# Altium schematic sheet Single Side Filter.SchDoc
size 287 x 198 mm; SheetNumber: 2; SheetTotal: 2
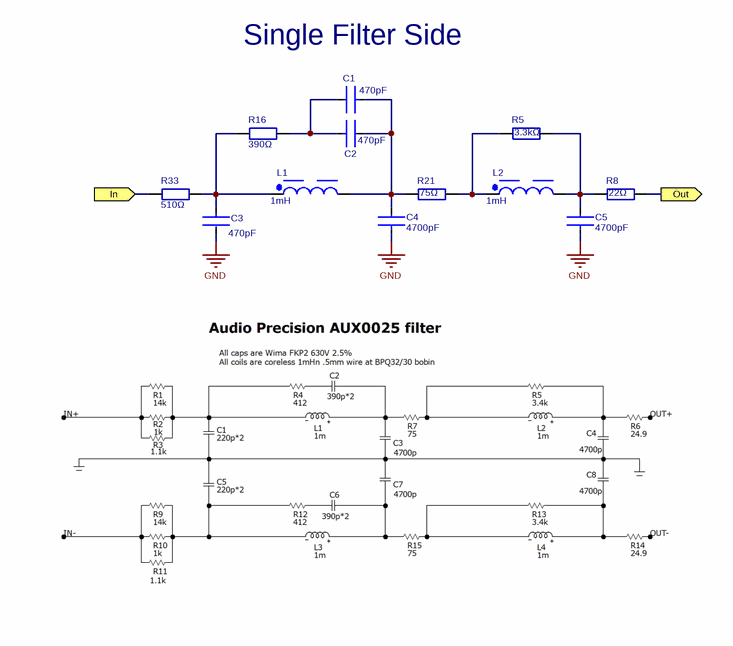
[diagram p0: Single Side Filter.SchDoc]

## Parts
C1  value 470pF  [Film Capacitor 7.2 x 4.5 x 6.0 mm]
C2  value 470pF  [Film Capacitor 7.2 x 4.5 x 6.0 mm]
C3  value 470pF  [Film Capacitor 7.2 x 4.5 x 6.0 mm]
C4  value 4700pF  [Film Capacitor 7.2 x 6.5 x 8.0 mm]
C5  value 4700pF  [Film Capacitor 7.2 x 6.5 x 8.0 mm]
L1  value 1mH  [WE-PD HV_1210]
L2  value 1mH  [WE-PD HV_1210]
R5  value 3.3kΩ  [RESC6432X06N]
R8  value 22Ω  [RESC6432X06N]
R16  value 390Ω  [RESC6432X06N]
R21  value 75Ω  [RESC6432X06N]
R33  value 510Ω  [RESC6432X06N]

## Ports
In (in), Out (out)

## Nets
GND: C3.2 C4.1 C5.1
In: R33.1 ; port In
Out: R8.2 ; port Out
NetC1_1: C1.1 C2.2 C4.2 L1.2 R21.1
NetC1_2: C1.2 C2.1 R16.2
NetC3_1: C3.1 L1.1 R16.1 R33.2
NetC5_2: C5.2 L2.2 R5.2 R8.1
NetL2_1: L2.1 R5.1 R21.2

## Notes on the sheet
- (near C1) Single Filter Side
- Redako
- Keilestraat 5a, 3029BP, Rotterdam, M: david@redako.nl, T: +31 6 16001008
- Project
- Title
- Customer
- Size:
- Date:
- File:
- A4
- Revision:
- Time:
- Drawn by:
- GIT Revision:
- Sheet:
- of

## Library data of the parts
C1-C3 = b4654b650e69147ec39a6b967a45e02: PFR5102F100J11L4BULK Cap Film 0.001uF 100V PP 1% (7.2 X 4.5 X 6mm) Radial 5mm 100C Bulk; MPN: FKP2J004701D00HS; Tolerance: 2.5%; Rating: 630V; Package: 7.2 x 6.5 x 8mm
C4 C5 = b4654b650e69147ec39a6b967a45e02: PFR5102F100J11L4BULK Cap Film 0.001uF 100V PP 1% (7.2 X 4.5 X 6mm) Radial 5mm 100C Bulk; MPN: FKP2J014701I00HS; Tolerance: 2.5%; Rating: 630V; Package: 7.2 x 4.5 x 6mm
L1 L2 = CMP-1387-00011-6: MPN: MSS1278T-105 / 7687709102; Tolerance: 10%; Rating: 1A
R5 R8 R16 R21 R33 = Res: Tolerance: 1%; Rating: 200V; Package: 2512